# EAGLE schematic main (EAGLE 7.7.0)
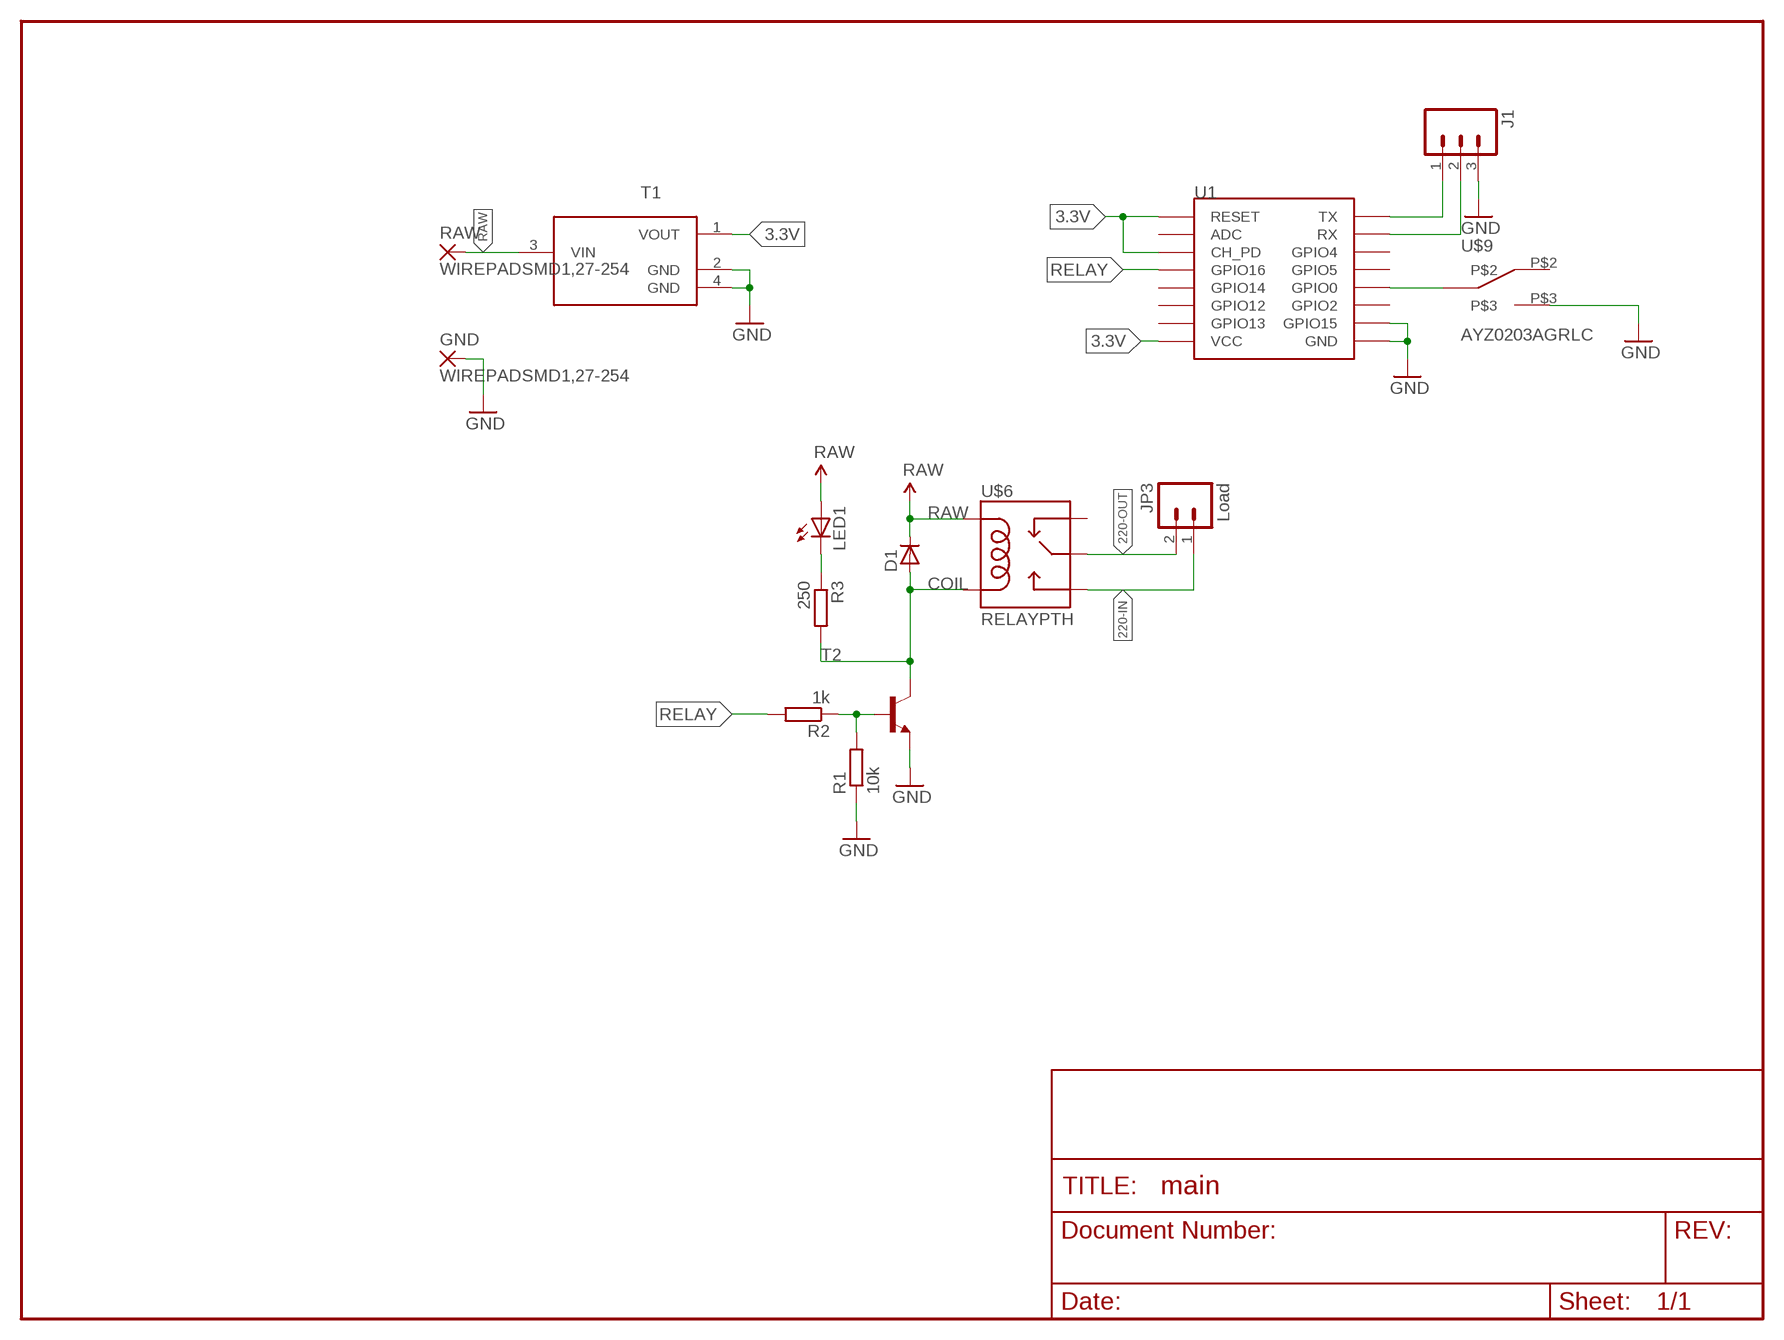
[diagram p0: schematic, sheet 1]

## Parts
D1  D-A1-C3  [SOT23]
GND  WIREPADSMD1,27-254  [SMD1,27-2,54]
J1  M03PTH  [1X03]
JP3  Load  M025MM  [SCREWTERMINAL-5MM-2]
LED1  LEDCHIPLED_0603  [CHIPLED_0603]
R1  10k  R-EU_R0603  [R0603]
R2  1k  R-EU_R0603  [R0603]
R3  250  R-EU_R0603  [R0603]
RAW  WIREPADSMD1,27-254  [SMD1,27-2,54]
T1  L78L33ACUTR  [SOT150P400X160-4N]
T2  BC808-NPN-SOT23-BEC  [SOT23-BEC]
U1  ESP12SMD  [ESP12-SMD]
U$6  RELAYPTH  [RELAY-G5Q]
U$9  AYZ0203AGRLC  [AYZ0203AGRLC]

## Nets
3.3V: T1.1(VOUT) U1.CH_PD U1.RESET U1.VCC
220-IN: JP3.1 U$6.3(NO)
220-OUT: JP3.2 U$6.2(MAIN)
COIL: D1.1(A) R3.2 T2.C U$6.1(COIL2)
GND: GND.1(P) J1.3 R1.1 T1.2(GND) T1.4(GND) T2.E U1.GND U1.GPIO15 U$9.P$3
N$1: LED1.C R3.1
N$3: U1.GPIO0 U$9.P$1(COM)
N$6: R1.2 R2.1 T2.B
RAW: D1.3(C) LED1.A RAW.1(P) T1.3(VIN) U$6.5(COIL1)
RELAY: R2.2 U1.GPIO16
RX: J1.2 U1.RXD0(RX)
TX: J1.1 U1.TXD0(TX)
Unconnected: U1.ADC U1.GPIO2 U1.GPIO4 U1.GPIO5 U1.GPIO12 U1.GPIO13 U1.GPIO14 U$6.4(NC) U$9.P$2

## Library data of the parts
D1 = semicon-smd-ipc:D-: DIODE unfilled
GND RAW = wirepad:WIREPAD: Wire PAD connect wire on PCB
J1 = SparkFun-Connectors:M03: Header 3 Standard 3-pin 0.1" header. Use with straight break away headers (SKU : PRT-00116), right angle break away headers (PRT-00553), swiss pins (PRT-00743), machine pins (PRT-00117), and female headers (PRT-00115). Molex polarized connector foot print use with SKU : PRT-08232 with associated crimp pins and housings.
JP3 = SparkFun:M02: Header 2 Standard 2-pin 0.1" header. Use with straight break away headers (SKU : PRT-00116), right angle break away headers (PRT-00553), swiss pins (PRT-00743), machine pins (PRT-00117), and female headers (PRT-00115). Molex polarized connector foot print use with SKU : PRT-08233 with associated crimp pins and housings.
LED1 = led:LED: LED OSRAM: - CHIPLED LG R971, LG N971, LY N971, LG Q971, LY Q971, LO R971, LY R971 LH N974, LH R974 LS Q976, LO Q976, LY Q976 LO Q996 - Hyper CHIPLED LW Q18S LB Q993, LB Q99A, LB R99A - SideLED LS A670, LO A670, LY A670, LG A670, LP A670 LB A673, LV A673, LT A673, LW A673 LH A674 LY A675 LS A676, LA A676, LO A676, LY A676, LW A676 LS A679, LY A679, LG A679 - Hyper Micro SIDELED® LS Y876, LA Y876, LO Y876, LY Y876 LT Y87S - SmartLED LW L88C, LW L88S LB L89C, LB L89S, LG L890 LS L89K, LO L89K, LY L89K LS L896, LA L896, LO L896, LY L896 - TOPLED LS T670, LO T670, LY T670, LG T670, LP T670 LSG T670, LSP T670, LSY T670, LOP T670, LYG T670 LG T671, LOG T671, LSG T671 LB T673, LV T673, LT T673, LW T673 LH T674 LS T676, LA T676, LO T676, LY T676, LB T676, LH T676, LSB T676, LW T676 LB T67C, LV T67C, LT T67C, LS T67K, LO T67K, LY T67K, LW E67C LS E67B, LA E67B, LO E67B, LY E67B, LB E67C, LV E67C, LT E67C LW T67C LS T679, LY T679, LG T679 LS T770, LO T770, LY T770, LG T770, LP T770 LB T773, LV T773, LT T773, LW T773 LH T774 LS E675, LA E675, LY E675, LS T675 LS T776, LA T776, LO T776, LY T776, LB T776 LHGB T686 LT T68C, LB T68C - Hyper Mini TOPLED® LB M676 - Mini TOPLED Santana® LG M470 LS M47K, LO M47K, LY M47K Source: http://www.osram.convergy.de LUXEON: - LUMILED® LXK2-PW12-R00, LXK2-PW12-S00, LXK2-PW14-U00, LXK2-PW14-V00 LXK2-PM12-R00, LXK2-PM12-S00, LXK2-PM14-U00 LXK2-PE12-Q00, LXK2-PE12-R00, LXK2-PE12-S00, LXK2-PE14-T00, LXK2-PE14-U00 LXK2-PB12-K00, LXK2-PB12-L00, LXK2-PB12-M00, LXK2-PB14-N00, LXK2-PB14-P00, LXK2-PB14-Q00 LXK2-PR12-L00, LXK2-PR12-M00, LXK2-PR14-Q00, LXK2-PR14-R00 LXK2-PD12-Q00, LXK2-PD12-R00, LXK2-PD12-S00 LXK2-PH12-R00, LXK2-PH12-S00 LXK2-PL12-P00, LXK2-PL12-Q00, LXK2-PL12-R00 Source: www.luxeon.com KINGBRIGHT: KA-3528ASYC Source: www.kingbright.com
R1-R3 = rcl:R-EU_: RESISTOR, European symbol
T1 = STM-STM8S003_L78LxxUTR:L78L: Positive voltage regulators(Output current up to 100 mA and Output voltages of 3.3; 5; 6; 8; 9; 10; 12; 15; 18;24 V); MPN: L78L33ACUTR; OC_FARNELL: 2253467; OC_NEWARK: 89K1361; PACKAGE: SOT-89; SUPPLIER: STMicroelectronics
T2 = transistor:*-NPN-: NPN Transistror BF959 corrected 2008.03.06
U1 = esp8266modules:ESP12: ESP8266 Wifi module 12
U$6 = SparkFun:RELAY
U$9 = AYZ0203AGRLC:AYZ0203AGRLC